# Altium schematic sheet PCB_Reflow_Arduino_V1.0.SchDoc: PCB Reflow
size A4; Date: 20/05/2022; Author: Gabriel Vega; DrawnBy: www.gabrielvegaeng.com; Engineer: Gabriel Vega; Organization: IFSC; Address1: Engenharia Mecatrônica; Address2: Florianópolis; Address4: By Gabriel Vega; Revision: V1.0; SheetNumber: 1; SheetTotal: 1
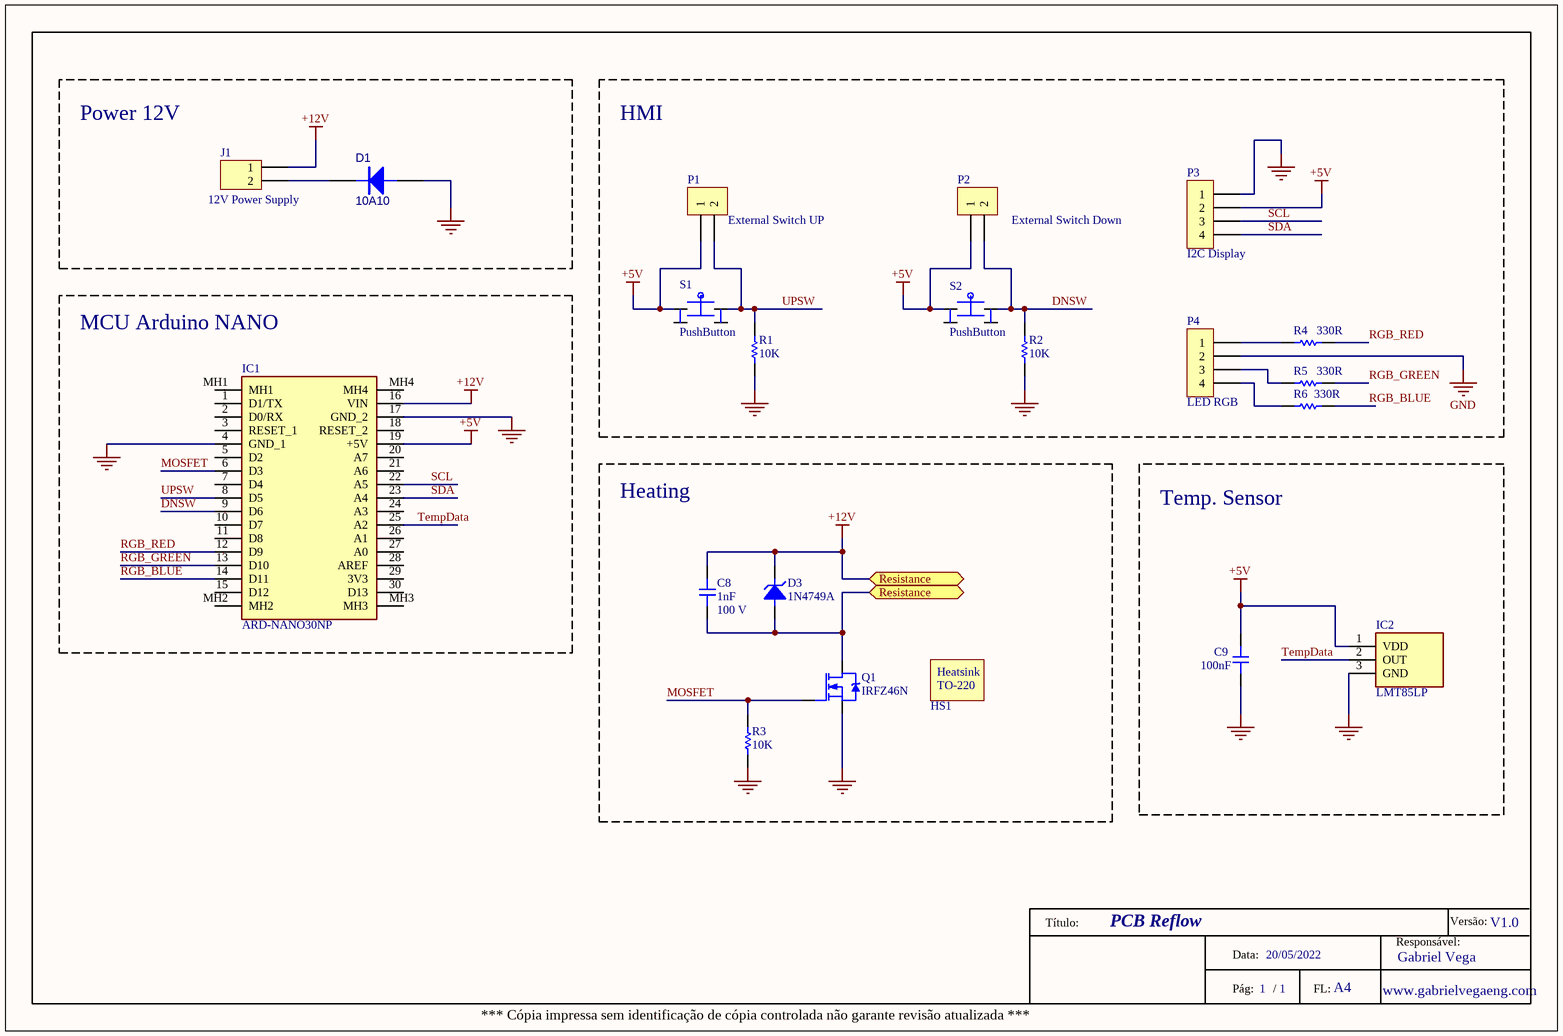
[diagram p0: PCB_Reflow_Arduino_V1.0.SchDoc]

## Parts
C8  1nF  Voltage: 100 V  [C100-200-100]
C9  100nF  [C100-200-100]
D1  10A10  [DIODE-8.6]
D3  1N4749A  [DO-41-Glass]
HS1  HS-TO-220  [HS-TO-220-180847]  (value not drawn)
IC1  ARD-NANO30NP  [ARDNANO30NP]
IC2  LMT85LP  [LMT85LP]
J1  12V Power Supply  [PHOENIX_1X2 - 180°]
P1  External Switch UP  [HDR-M-1x2-2.54mm-180-9.2mm]
P2  External Switch Down  [HDR-M-1x2-2.54mm-180-9.2mm]
P3  I2C Display  [HDR-M-1x4-2.54mm-180-9.2mm]
P4  LED RGB  [HDR-M-1x4-2.54mm-180-9.2mm]
Q1  IRFZ46N  [TO-220/123]
R1  10K  [R400-2.0mm]
R2  10K  [R400-2.0mm]
R3  10K  [R400-2.0mm]
R4  330R  [R400-2.0mm]
R5  330R  [R400-2.0mm]
R6  330R  [R400-2.0mm]
S1  PushButton  [DTS-6.0mm-6.0mm-THT]
S2  PushButton  [DTS-6.0mm-6.0mm-THT]

## Blocks framed on the sheet
Power 12V: D1 J1
HMI: P1-P4 R1 R2 R4-R6 S1 S2
MCU Arduino NANO: IC1
Heating: C8 D3 HS1 Q1 R3
Temp. Sensor: C9 IC2

## Ports
Resistance

## Nets
+5V: C9.2 IC1.19(+5V) IC2.1(VDD) P1.1 P2.1 P3.2 S1.1 S2.1
+12V: C8.1 C8.2 D3.A D3.K IC1.16(VIN) J1.1 Q1.D ; port Resistance
GND: C9.1 D1.1(A) IC1.4(GND_1) IC1.17(GND_2) IC2.3(GND) P3.1 P4.2 Q1.S R1.1 R2.1 R3.1
DNSW: IC1.9(D6) P2.2 R2.2 S2.3
MOSFET: IC1.6(D3) Q1.G R3.2
RGB_BLUE: IC1.14(D11) R6.1
RGB_GREEN: IC1.13(D10) R5.1
RGB_RED: IC1.12(D9) R4.1
SCL: IC1.22(A5) P3.3
SDA: IC1.23(A4) P3.4
TempData: IC1.25(A2) IC2.2(OUT)
UPSW: IC1.8(D5) P1.2 R1.2 S1.3
NetD1_2: D1.2(K) J1.2
NetP4_1: P4.1 R4.2
NetP4_3: P4.3 R5.2
NetP4_4: P4.4 R6.2

Not connected (* = marked no-connect by the designer): IC1 1(D1/TX) 2(D0/RX) 3(RESET_1) 5(D2) 7(D4) 10(D7) 11(D8) 15(D12) 18(RESET_2) 20(A7) 21(A6) 24(A3) 26(A1) 27(A0) 28(AREF) 29(3V3) 30(D13) MH1 MH2 MH3 MH4; S1 2 4; S2 2 4

## Notes on the sheet
- Versão:
- Título:
- Data:
- Pág:
- /
- FL:
- A4
- Responsável:
- *** Cópia impressa sem identificação de cópia controlada não garante revisão atualizada ***
- (in symbol HS-TO-220) Heatsink; TO-220

## Library data of the parts
C8 = Capacitor: Published: 8-Jun-2000; LatestRevisionDate: 17-Jul-2002; LatestRevisionNote: Re-released for DXP Platform.; PackageReference: RAD-0.3; Publisher: Altium Limited
C9 = Capacitor: Voltage: 100 V; Published: 8-Jun-2000; LatestRevisionDate: 17-Jul-2002; LatestRevisionNote: Re-released for DXP Platform.; PackageReference: RAD-0.3; Publisher: Altium Limited
D1 = 10A10: Diodo
D3 = 1N4749A: Zener Diode; Zener Voltage (Vz): 24 V; Zener Current (Iz): 38 mA; Power Dissipation (Pd): 1.3 W; Forward Voltage (Vf): 1.2 V
HS1 = HS-TO-220: Heatsink TO-220
IC1 = ARD-NANO30NP: Integrated Circuit; Manufacturer_Name: Gravitech; Datasheet Link: http://www.mouser.com/datasheet/2/595/Arduino_Nano3_0-220057.pdf; Height: 5mm; Manufacturer_Part_Number: ARD-NANO30NP; Mouser Part Number: 992-ARD-NANO30NP; Mouser Price/Stock: https://www.mouser.co.uk/ProductDetail/Gravitech/ARD-NANO30NP?qs=Vxac6xGyzPlh7in3DWNTbQ%3D%3D
IC2 = LMT85LP: Integrated Circuit; Manufacturer_Name: Texas Instruments; Datasheet Link: https://www.ti.com/lit/ds/symlink/lmt85.pdf?HQS=dis-mous-null-mousermode-dsf-pf-null-wwe&ts=1635242341074&ref_url=https%253A%252F%252Fwww.mouser.de%252F; Height: 5.34mm; Manufacturer_Part_Number: LMT85LP; Mouser Part Number: 595-LMT85LP; Mouser Price/Stock: https://www.mouser.co.uk/ProductDetail/Texas-Instruments/LMT85LP?qs=U0ECReq1GB%2FnA9zQwQMysg%3D%3D; Arrow Part Number: LMT85LP; Arrow Price/Stock: https://www.arrow.com/en/products/lmt85lp/texas-instruments?region=nac
J1 = Phoenix_1x2: Phoenix connector, 1 Lines, 2 Columns, 2 Pins
P1 P2 = Header_1x2: Header, 1 Line, 2 Columns, 2 Pins; LatestRevisionDate: 17-Jul-2002; LatestRevisionNote: Re-released for DXP Platform.; Publisher: Altium Limited
P3 P4 = Header_1x4: Header, 1 Line, 4 Columns, 4 Pins; LatestRevisionDate: 17-Jul-2002; LatestRevisionNote: Re-released for DXP Platform.; Publisher: Altium Limited
Q1 = IRFZ46N: HEXFET Power MOSFET; pin to pad: D>2 G>1 S>3; Drain Current (Id): 53 A; Drain Current Peak (Idp): 180 A; Power Dissipation (Pd): 107 W; Gate-to-Source Voltage (Vgs): 20 V; Static Drain-to-Source On-Resistance (Rdson): 16.5 mR; Turn-On Delay (tdon): 14 ns; Rise Time (Rt): 76 ns; Fall Time (Tf): 57 ns; Turn-Off Delay (Tdoff): 52 ns
R1-R3 = Resistor: Tolerance: 5%; Power: 1/4 W; Published: 8-Jun-2000; LatestRevisionDate: 17-Jul-2002; LatestRevisionNote: Re-released for DXP Platform.; PackageReference: AXIAL-0.3; Publisher: Altium Limited
R4-R6 = Resistor: Tolerance: 5%; Published: 8-Jun-2000; LatestRevisionDate: 17-Jul-2002; LatestRevisionNote: Re-released for DXP Platform.; PackageReference: AXIAL-0.3; Publisher: Altium Limited
S1 S2 = PushButton_4: Tactile Switch SPST 4 pins